# EAGLE design MAME-Controller (EAGLE 6.4)
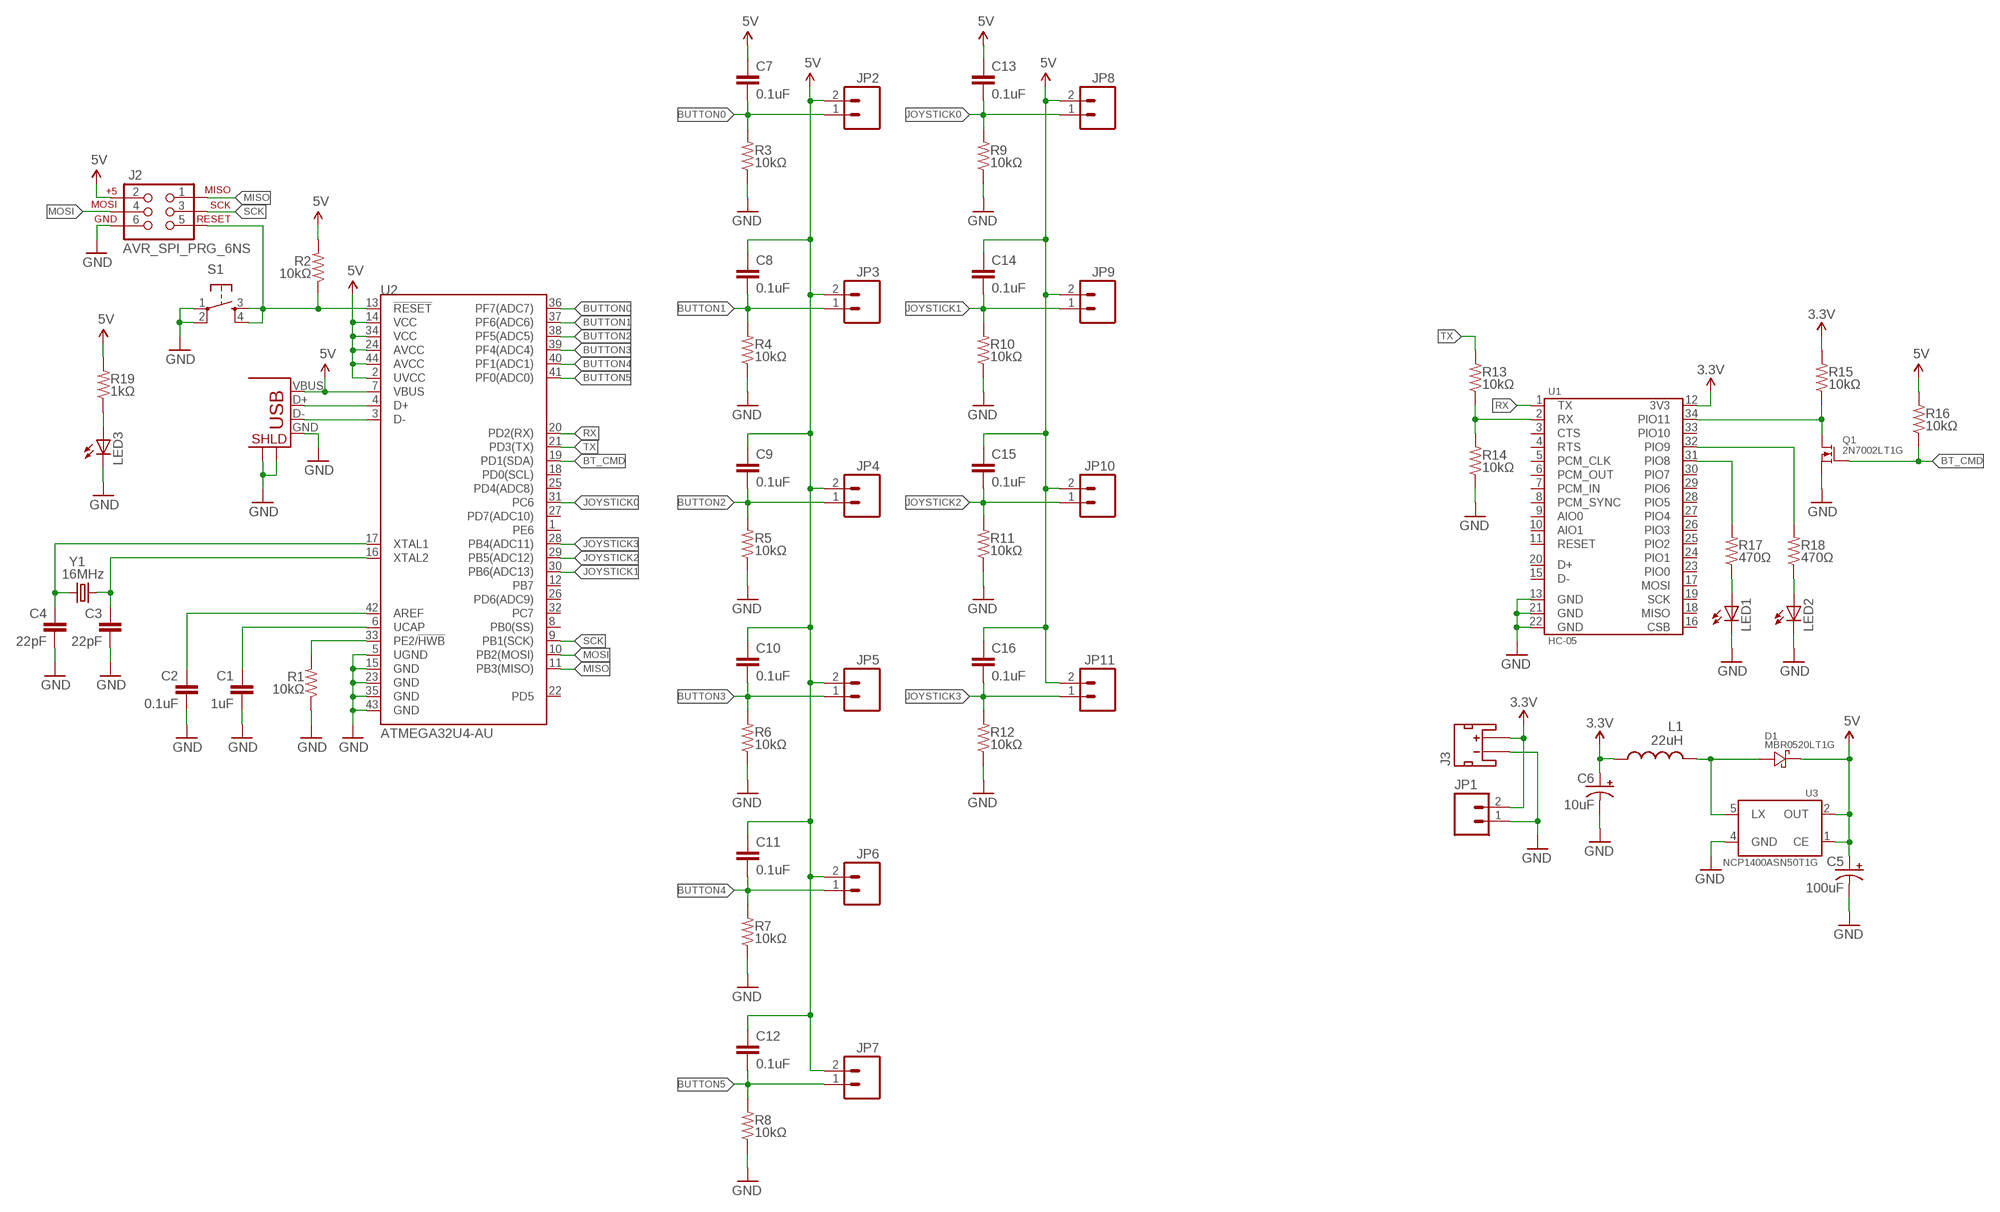
[diagram p0: schematic, sheet 1]

## Parts
C1  1uF  CAP0805  [0805]
C2  0.1uF  CAP0805  [0805]
C3  22pF  CAP0805  [0805]
C4  22pF  CAP0805  [0805]
C5  100uF  CAP_POL-0.35X0.5  [CAP_POL-0.35X0.5]
C6  10uF  CAP_POL1206-KIT  [EIA3216-KIT]
C7  0.1uF  CAP0805  [0805]
C8  0.1uF  CAP0805  [0805]
C9  0.1uF  CAP0805  [0805]
C10  0.1uF  CAP0805  [0805]
C11  0.1uF  CAP0805  [0805]
C12  0.1uF  CAP0805  [0805]
C13  0.1uF  CAP0805  [0805]
C14  0.1uF  CAP0805  [0805]
C15  0.1uF  CAP0805  [0805]
C16  0.1uF  CAP0805  [0805]
D1  MBR0520LT1G  [SOD123]
J1  USB+SHIELD  [USB-B-PTH]
J2  AVR_SPI_PRG_6NS  [2X3-NS]
J3  JST_2MM_MALE  [JST-2-SMD]
JP1  M02PTH  [1X02]
JP2  M02POLAR  [MOLEX-1X2]
JP3  M02POLAR  [MOLEX-1X2]
JP4  M02POLAR  [MOLEX-1X2]
JP5  M02POLAR  [MOLEX-1X2]
JP6  M02POLAR  [MOLEX-1X2]
JP7  M02POLAR  [MOLEX-1X2]
JP8  M02POLAR  [MOLEX-1X2]
JP9  M02POLAR  [MOLEX-1X2]
JP10  M02POLAR  [MOLEX-1X2]
JP11  M02POLAR  [MOLEX-1X2]
L1  22uH  INDUCTOR0805  [0805]
LED1  LED-FKIT-1206  [FKIT-LED-1206]
LED2  LED-FKIT-1206  [FKIT-LED-1206]
LED3  LED-FKIT-1206  [FKIT-LED-1206]
Q1  2N7002LT1G  [SOT23]
R1  10kΩ  RESISTOR0805-RES  [0805]
R2  10kΩ  RESISTOR0805-RES  [0805]
R3  10kΩ  RESISTOR0805-RES  [0805]
R4  10kΩ  RESISTOR0805-RES  [0805]
R5  10kΩ  RESISTOR0805-RES  [0805]
R6  10kΩ  RESISTOR0805-RES  [0805]
R7  10kΩ  RESISTOR0805-RES  [0805]
R8  10kΩ  RESISTOR0805-RES  [0805]
R9  10kΩ  RESISTOR0805-RES  [0805]
R10  10kΩ  RESISTOR0805-RES  [0805]
R11  10kΩ  RESISTOR0805-RES  [0805]
R12  10kΩ  RESISTOR0805-RES  [0805]
R13  10kΩ  RESISTOR0805-RES  [0805]
R14  10kΩ  RESISTOR0805-RES  [0805]
R15  10kΩ  RESISTOR0805-RES  [0805]
R16  10kΩ  RESISTOR0805-RES  [0805]
R17  470Ω  RESISTOR0805-RES  [0805]
R18  470Ω  RESISTOR0805-RES  [0805]
R19  1kΩ  RESISTOR0805-RES  [0805]
S1  TAC_SWITCHSMD  [TACTILE_SWITCH_SMD]
U1  HC-05  [HC-05]
U2  ATMEGA32U4-AU  [TQFP-44]
U3  NCP1400ASN50T1G  [SOT23-5]
Y1  16MHz  CRYSTALHC49US  [HC49US]

## Nets
3.3V: C6.A(+) J3.2(+) JP1.2 L1.2 R15.2 U1.12(3V3)
5V: C5.+ C7.1 C8.1 C9.1 C10.1 C11.1 C12.1 C13.1 C14.1 C15.1 C16.1 D1.CATHODE(C) J1.VBUS J2.2 JP2.2 JP3.2 JP4.2 JP5.2 JP6.2 JP7.2 JP8.2 JP9.2 JP10.2 JP11.2 R2.2 R16.2 R19.2 U2.2(UVCC) U2.7(VBUS) U2.14(VCC) U2.24(AVCC) U2.34(VCC) U2.44(AVCC) U3.1(CE) U3.2(OUT)
BT_CMD: Q1.1(GATE) R16.1 U2.19(PD1(SDA))
BUTTON0: C7.2 JP2.1 R3.2 U2.36(PF7(ADC7))
BUTTON1: C8.2 JP3.1 R4.2 U2.37(PF6(ADC6))
BUTTON2: C9.2 JP4.1 R5.2 U2.38(PF5(ADC5))
BUTTON3: C10.2 JP5.1 R6.2 U2.39(PF4(ADC4))
BUTTON4: C11.2 JP6.1 R7.2 U2.40(PF1(ADC1))
BUTTON5: C12.2 JP7.1 R8.2 U2.41(PF0(ADC0))
D_N: J1.D- U2.3(D-)
D_P: J1.D+ U2.4(D+)
GND: C1.2 C2.2 C3.2 C4.2 C5.- C6.C(-) J1.GND J1.S1 J1.S2 J2.6 J3.1(-) JP1.1 LED1.C LED2.C LED3.C Q1.2(SOURCE) R1.1 R3.1 R4.1 R5.1 R6.1 R7.1 R8.1 R9.1 R10.1 R11.1 R12.1 R14.1 S1.1 S1.2 U1.13(GND) U1.21(GND) U1.22(GND) U2.5(UGND) U2.15(GND) U2.23(GND) U2.35(GND) U2.43(GND) U3.4(GND)
JOYSTICK0: C13.2 JP8.1 R9.2 U2.31(PC6)
JOYSTICK1: C14.2 JP9.1 R10.2 U2.30(PB6(ADC13))
JOYSTICK2: C15.2 JP10.1 R11.2 U2.29(PB5(ADC12))
JOYSTICK3: C16.2 JP11.1 R12.2 U2.28(PB4(ADC11))
MISO: J2.1 U2.11(PB3(MISO))
MOSI: J2.4 U2.10(PB2(MOSI))
N$1: R1.2 U2.33(PE2/!HWB)
N$2: C1.1 U2.6(UCAP)
N$3: C2.1 U2.42(AREF)
N$6: C4.1 U2.17(XTAL1) Y1.1
N$7: C3.1 U2.16(XTAL2) Y1.2
N$8: J2.5 R2.1 S1.3 S1.4 U2.13(!RESET)
N$9: D1.ANODE(A) L1.1 U3.5(LX)
N$10: R13.1 R14.2 U1.2(RX)
N$11: R17.2 U1.31(PIO8)
N$12: R18.2 U1.32(PIO9)
N$13: Q1.3(DRAIN) R15.1 U1.34(PIO11)
N$14: LED2.A R18.1
N$15: LED1.A R17.1
N$16: LED3.A R19.1
RX: U1.1(TX) U2.20(PD2(RX))
SCK: J2.3 U2.9(PB1(SCK))
TX: R13.2 U2.21(PD3(TX))
Unconnected: J3.NC1(PAD1) J3.NC2(PAD2) U1.3(CTS) U1.4(RTS) U1.5(PCM_CLK) U1.6(PCM_OUT) U1.7(PCM_IN) U1.8(PCM_SYNC) U1.9(AIO0) U1.10(AIO1) U1.11(RESET) U1.15(D-) U1.16(CSB) U1.17(MOSI) U1.18(MISO) U1.19(SCK) U1.20(D+) U1.23(PIO0) U1.24(PIO1) U1.25(PIO2) U1.26(PIO3) U1.27(PIO4) U1.28(PIO5) U1.29(PIO6) U1.30(PIO7) U1.33(PIO10) U2.1(PE6) U2.8(PB0(SS)) U2.12(PB7) U2.18(PD0(SCL)) U2.22(PD5) U2.25(PD4(ADC8)) U2.26(PD6(ADC9)) U2.27(PD7(ADC10)) U2.32(PC7)

## Library data of the parts
C1-C4 C7-C16 = SparkFun-Passives:CAP: Capacitor Standard 0603 ceramic capacitor, and 0.1" leaded capacitor.
C5 = Passives:CAP_POL
C6 = SparkFun-Passives:CAP_POL: Capacitor Polarized These are standard SMD and PTH capacitors. Normally 10uF, 47uF, and 100uF in electrolytic and tantalum varieties. Always verify the external diameter of the through hole cap, it varies with capacity, voltage, and manufacturer. The EIA devices should be standard.
D1 = ON Semiconductor:MBR0520
J1 = SparkFun-Connectors:USB+SHIELD: USB+Shield USB connector with shield pins connectable
J2 = SparkFun-Connectors:AVR_SPI_PRG_6: AVR ISP 6 Pin This is the reduced ISP connector for AVR programming. Common on Arduino. This footprint will take up less PCB space and can be used with a 10-pin to 6-pin adapter such as SKU: BOB-08508
J3 = SparkFun-Connectors:JST_2MM_MALE: Mates to single-cell LiPo batteries. CONN-08352; PROD_ID: CONN-08352
JP1-JP11 = SparkFun-Connectors:M02: Header 2 Standard 2-pin 0.1" header. Use with straight break away headers (SKU : PRT-00116), right angle break away headers (PRT-00553), swiss pins (PRT-00743), machine pins (PRT-00117), and female headers (PRT-00115). Molex polarized connector foot print use with SKU : PRT-08233 with associated crimp pins and housings.
L1 = SparkFun-Passives:INDUCTOR: Inductors Basic Inductor/Choke - 0603 and 1206. Footprints are not proven and vary greatly between part numbers.
LED1-LED3 = SparkFun-LED:LED: LEDs Standard schematic elements and footprints for 5mm, 3mm, 1206, and 0603 sized LEDs. 5mm - Spark Fun Electronics SKU : COM-00529 (and others)
Q1 = work:2N7002LT1G: N-Channel Enchancement Mode Mosfet DigiKey: 2N7002LT1GOSCT-ND
R1-R19 = SparkFun-Passives:RESISTOR: Resistor Basic schematic elements and footprints for 0603, 1206, and PTH resistors.
S1 = SparkFun-Electromechanical:TAC_SWITCH: Momentary Switch Button commonly used for reset or general input. Spark Fun Electronics SKU : COM-00097 SMT- SWCH-08247; PROD_ID: SWCH-08247
U1 = Passives:HC-05
U2 = Atmel:ATMEGA32U4
U3 = ON Semiconductor:NCP1400
Y1 = SparkFun-FreqCtrl:CRYSTAL: Various standard crystals. Proven footprints. Spark Fun Electronics SKU : COM-00534

## Net classes
1 usb: clearance 0.508 mm

## Board
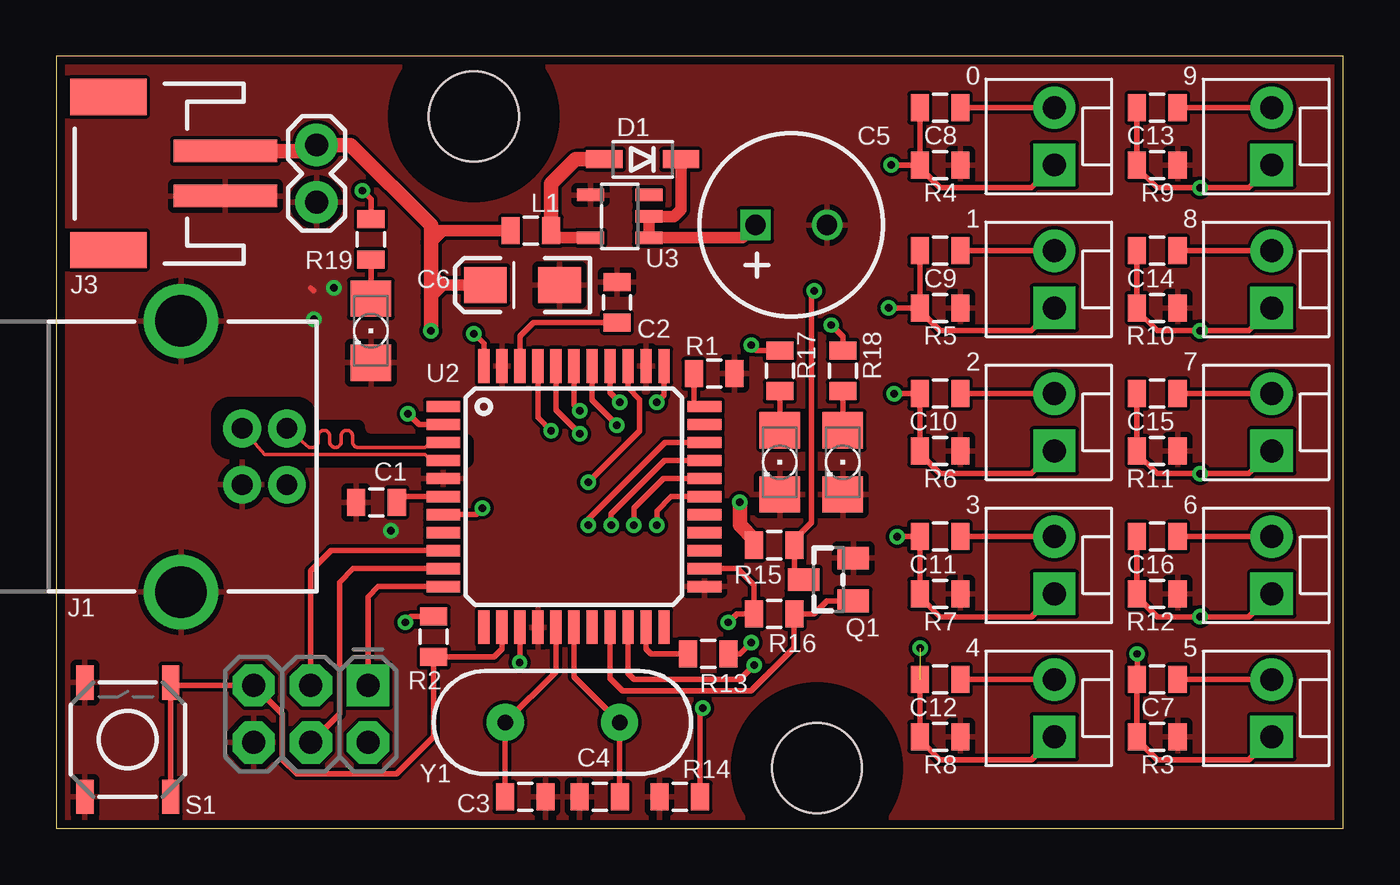
[diagram p1: board, top side]
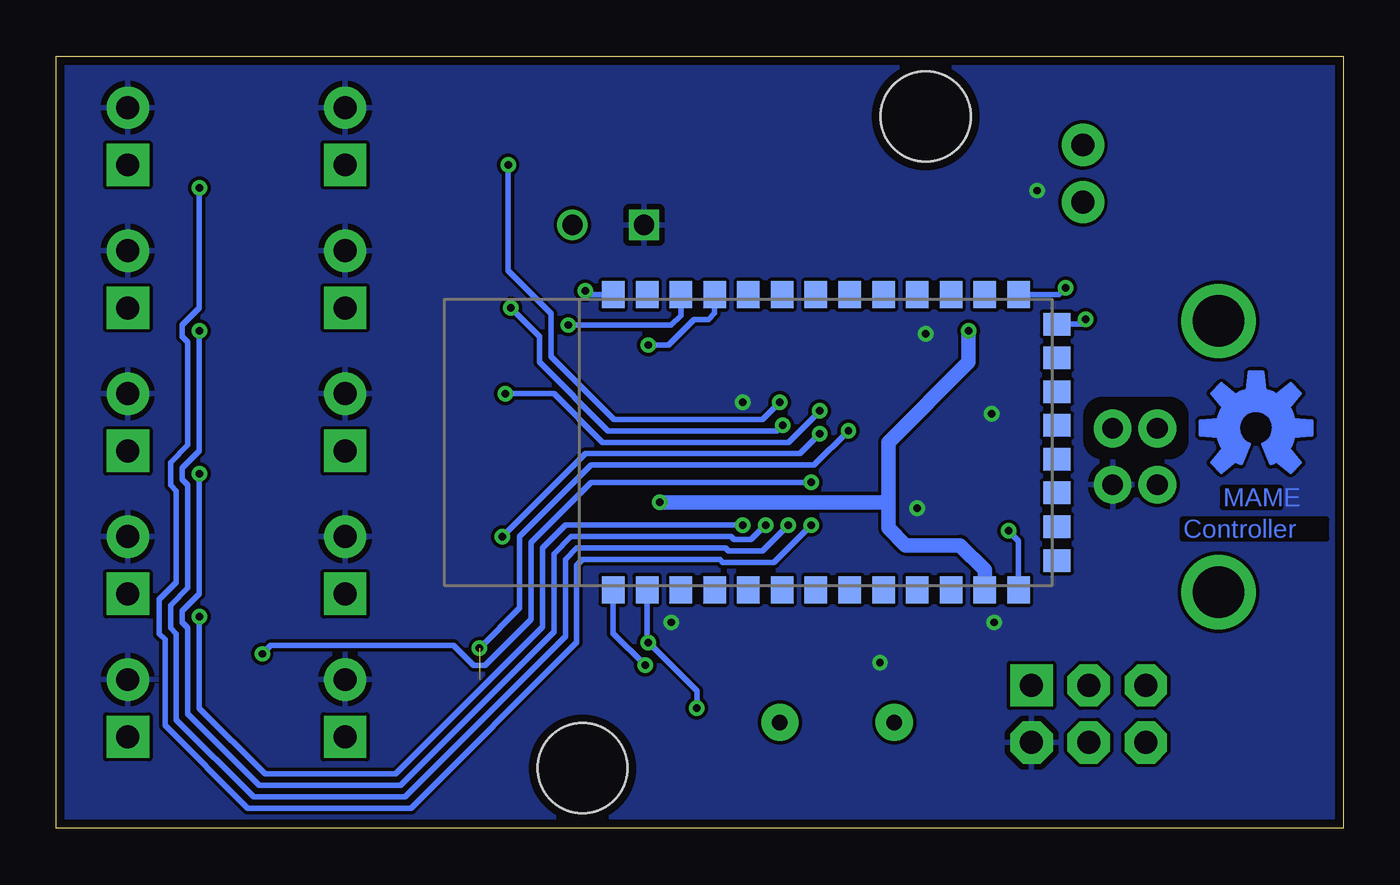
[diagram p2: board, bottom side, seen from below]

Size 57.15 x 34.29 mm. Coordinates in mm from the lower left corner, seen from the top.
Outline: 0,0 57.15,0 57.15,34.29 0,34.29 0,0
Copper layers (1*16): Top 0.0356mm / dielectric 1.5011mm / Bottom 0.0356mm
Design rules "oshpark-2layer *": minimum track width 6mil, minimum drill 13mil, track to track 6mil, track to pad 6mil, pad to pad 6mil, via to via 6mil, smd to smd 6mil, copper to edge 15mil, drill to drill 6mil, minimum pad ring 7mil, minimum via ring 7mil, stop-mask expansion 4mil, vias tented up to drill 20mil, thermal gap 10mil
Holes 4 mm at 18.54,31.62 33.78,2.67
tRestrict: area 7,16.1 to 18.4,19.1; area 30.2,-0.9 to 37.3,6.2; area 15,28.1 to 22.1,35.2
bRestrict: area 7,16.5 to 11.4,19.1

### Footprints (pad centres in the part's own frame; a part is rotated, then mirrored left to right if it is on the bottom)
0805 = smd 0.8 x 1.2: 1 -0.9,0; 2 0.9,0
CAP_POL-0.35X0.5 = drill 0.9 square: + 1.587,0 | drill 0.9: - -1.587,0
EIA3216-KIT = smd 1.9 x 1.6: A 1.65,0; C -1.65,0
SOD123 = smd 1.6 x 0.8: ANODE 1.7,0; CATHODE -1.7,0
USB-B-PTH = drill 0.914 pad 1.676: D+ 0,1.25; D- 1.981,1.25; GND 0,-1.25; VBUS 1.981,-1.25 | drill 2.286: S1 -2.718,-6.02; S2 -2.718,6.02
2X3-NS = drill 1.016 pad 1.88 square: 1 -2.54,-1.27 | drill 1.016 pad 1.88 octagon: 2 -2.54,1.27; 3 0,-1.27; 4 0,1.27; 5 2.54,-1.27; 6 2.54,1.27
JST-2-SMD = smd 1 x 4.6: 1 -1,-3.7; 2 1,-3.7 | smd 1.6 x 3.4: NC1 -3.4,1.5; NC2 3.4,1.5
1X02 = drill 1.016 pad 1.88: 1 0,0; 2 2.54,0
MOLEX-1X2 = drill 1.016 pad 1.88 square: 1 0,0 | drill 1.016 pad 1.88: 2 2.54,0
FKIT-LED-1206 = smd 1.6 x 1.803: A -1.422,0; C 1.422,0
SOT23 = smd 1 x 1.4: 1 -0.95,-1.1; 2 0.95,-1.1; 3 0,1.1
TACTILE_SWITCH_SMD = smd 1.524 x 0.762: 1 -2.54,1.905; 2 2.54,1.905; 3 -2.54,-1.905; 4 2.54,-1.905
HC-05 = smd 1.2 x 1: 1 -6.55,6; 2 -6.55,4.5; 3 -6.55,3; 4 -6.55,1.5; 5 -6.55,0; 6 -6.55,-1.5; 7 -6.55,-3; 8 -6.55,-4.5; 9 -6.55,-6; 10 -6.55,-7.5; 11 -6.55,-9; 12 -6.55,-10.5; 13 -6.55,-12; 22 6.55,-12; 23 6.55,-10.5; 24 6.55,-9; 25 6.55,-7.5; 26 6.55,-6; 27 6.55,-4.5; 28 6.55,-3; 29 6.55,-1.5; 30 6.55,0; 31 6.55,1.5; 32 6.55,3; 33 6.55,4.5; 34 6.55,6 | smd 1 x 1.2: 14 -5.25,-13.7; 15 -3.75,-13.7; 16 -2.25,-13.7; 17 -0.75,-13.7; 18 0.75,-13.7; 19 2.25,-13.7; 20 3.75,-13.7; 21 5.25,-13.7
TQFP-44 = smd 1.5 x 0.5: 1 -5.8,4; 2 -5.8,3.2; 3 -5.8,2.4; 4 -5.8,1.6; 5 -5.8,0.8; 6 -5.8,0; 7 -5.8,-0.8; 8 -5.8,-1.6; 9 -5.8,-2.4; 10 -5.8,-3.2; 11 -5.8,-4; 23 5.8,-4; 24 5.8,-3.2; 25 5.8,-2.4; 26 5.8,-1.6; 27 5.8,-0.8; 28 5.8,0; 29 5.8,0.8; 30 5.8,1.6; 31 5.8,2.4; 32 5.8,3.2; 33 5.8,4 | smd 0.5 x 1.5: 12 -4,-5.8; 13 -3.2,-5.8; 14 -2.4,-5.8; 15 -1.6,-5.8; 16 -0.8,-5.8; 17 0,-5.8; 18 0.8,-5.8; 19 1.6,-5.8; 20 2.4,-5.8; 21 3.2,-5.8; 22 4,-5.8; 34 4,5.8; 35 3.2,5.8; 36 2.4,5.8; 37 1.6,5.8; 38 0.8,5.8; 39 0,5.8; 40 -0.8,5.8; 41 -1.6,5.8; 42 -2.4,5.8; 43 -3.2,5.8; 44 -4,5.8
SOT23-5 = smd 0.55 x 1.2: 1 -0.95,-1.3; 2 0,-1.3; 3 0.95,-1.3; 4 0.95,1.3; 5 -0.95,1.3
HC49US = drill 0.7 pad 1.651: 1 -2.54,0; 2 2.54,0

### Placement (x,y rotation side)
C1  14.22,14.48 180 top
C2  24.89,23.37 90 top
C3  20.83,1.4 0 top
C4  24.13,1.4 180 top
C5  32.64,26.8 180 top
C6  20.7,24.13 180 top
C7  48.9,6.6 180 top
C8  39.24,32 180 top
C9  39.24,25.65 180 top
C10  39.24,19.3 180 top
C11  39.24,12.95 180 top
C12  39.24,6.6 180 top
C13  48.9,32 180 top
C14  48.9,25.65 180 top
C15  48.9,19.3 180 top
C16  48.9,12.95 180 top
D1  26.04,29.72 180 top
J1  8.26,16.51 0 top
J2  11.3,5.08 180 top
J3  3.81,29.08 90 top
JP1  11.56,27.81 90 top
JP2  53.98,4.06 90 top
JP3  44.32,29.46 90 top
JP4  44.32,23.11 90 top
JP5  44.32,16.76 90 top
JP6  44.32,10.41 90 top
JP7  44.32,4.06 90 top
JP8  53.98,29.46 90 top
JP9  53.98,23.11 90 top
JP10  53.98,16.76 90 top
JP11  53.98,10.41 90 top
L1  21.08,26.54 180 top
LED1  32.13,16.26 270 top
LED2  34.92,16.26 270 top
LED3  13.97,22.1 270 top
Q1  34.29,11.05 90 top
R1  29.21,20.19 180 top
R2  16.76,8.51 90 top
R3  48.9,4.06 180 top
R4  39.24,29.46 180 top
R5  39.24,23.11 180 top
R6  39.24,16.76 180 top
R7  39.24,10.41 180 top
R8  39.24,4.06 180 top
R9  48.9,29.46 180 top
R10  48.9,23.11 180 top
R11  48.9,16.76 180 top
R12  48.9,10.41 180 top
R13  28.96,7.75 180 top
R14  27.69,1.4 0 top
R15  31.88,12.57 180 top
R16  31.88,9.53 180 top
R17  32.13,20.32 90 top
R18  34.92,20.32 90 top
R19  13.97,26.16 90 top
S1  3.17,3.94 90 top
U1  26.42,17.14 90 bottom
U2  22.99,14.73 0 top
U3  25.02,27.18 90 top
U$1  [OSHW-LOGO-M-TOP]  3.87,17.78 0 bottom
Y1  22.48,4.7 180 top

### Tracks (layer width: path | path; a pad name or v marks a point on that pad's centre or on a via)
3.3V  (via drill 0.33)
  Top 0.508: L1.2 17.14,26.54 | 17.14,26.54 16.76,26.54 16.64,26.67 | C6.A 17.14,24.13 | 17.14,24.13 16.76,24.13 16.64,24.26 | 17.14,24.13 16.64,24.64 | 17.14,24.13 16.64,23.62 | 17.14,26.54 16.64,26.04
  Top 0.635: J3.2 11.29,30.08 JP1.2 13.08,30.35 16.64,26.8 16.64,26.67 16.64,26.04 16.64,24.64 16.64,24.26 16.64,23.62 v16.64,22.1 | R15.2 30.98,12.84 30.35,13.46 v30.35,14.48
  Bottom 0.635: v16.64,22.1 16.64,20.7 20.19,17.14 20.19,14.48 | 20.19,14.48 20.19,13.34 19.43,12.57 17.02,12.57 15.92,11.47 U1.12 | 20.19,14.48 v30.35,14.48
5V  (via drill 0.33)
  Top 0.254: U2.7 18.63,13.93 v18.92,14.22 | U2.34 26.99,19.24 v26.67,18.92 | v29.84,9.14 30.23,9.53 R16.2 30.98,10.81 30.25,11.53 U2.24 | U2.2 16.1,17.93 v15.62,18.41 | U2.44 18.99,21.53 v18.54,21.97 | R19.2 13.97,27.94 v13.59,28.32 | JP8.2 C13.1 | JP9.2 C14.1 | JP10.2 C15.1 | JP11.2 C16.1 | JP2.2 C7.1 | JP3.2 C8.1 | JP4.2 C9.1 | JP5.2 C10.1 | JP6.2 C11.1 | JP7.2 C12.1 | U2.14 20.59,7.38 v20.57,7.37 | R2.2 15.76,9.41 v15.49,9.14
  Top 0.508: D1.CATHODE 27.73,27.48 27.43,27.18 U3.2 U3.1 30.48,26.23 C5.+
  pour Bottom: -2.54,-2.54 59.69,-2.54 59.69,36.83 -2.54,36.83
BT_CMD
  Top 0.254: Q1.1 34.23,10.1 33.66,9.53 R16.1 32.77,9.51 32.77,8.01 30.86,6.1 25.15,6.1 24.59,6.66 U2.19
BUTTON0  (via drill 0.33)
  Top 0.254: JP2.1 52.96,3.05 48.9,3.05 47.99,3.95 R3.2 C7.2 48.01,6.62 v48.01,7.75 | U2.36 25.39,19.57 25.91,19.05 25.91,17.65 v23.62,15.37
  Bottom 0.254: v23.62,15.37 33.4,15.37 36.07,12.7 36.07,9.27 38.1,7.24 38.61,7.24 39.5,8.13 47.62,8.13 v48.01,7.75
BUTTON1  (via drill 0.33)
  Top 0.254: JP3.1 43.31,28.45 39.24,28.45 38.34,29.35 R4.2 | R4.2 C8.2 | U2.37 24.59,19.36 v25.02,18.92 | v37.08,29.46 R4.2
  Bottom 0.254: v25.02,18.92 25.78,18.16 32.38,18.16 35.18,20.95 35.18,22.86 37.08,24.77 v37.08,29.46
BUTTON2  (via drill 0.33)
  Top 0.254: JP4.1 43.31,22.1 39.24,22.1 38.34,23 R5.2 | R5.2 C9.2 | U2.38 23.79,19.01 v24.89,17.91 | v36.96,23.11 R5.2
  Bottom 0.254: v24.89,17.91 25.15,17.65 32.64,17.65 35.69,20.7 35.69,21.84 v36.96,23.11
BUTTON3  (via drill 0.33)
  Top 0.254: JP5.1 43.31,15.75 39.24,15.75 38.34,16.65 R6.2 C10.2 v37.21,19.3 | U2.39 22.99,18.8 v23.24,18.54
  Bottom 0.254: v23.24,18.54 24.64,17.14 32.89,17.14 35.05,19.3 v37.21,19.3
BUTTON4  (via drill 0.33)
  Top 0.254: JP6.1 43.31,9.4 39.24,9.4 38.34,10.3 R7.2 C11.2 v37.34,12.95 | U2.40 22.19,18.58 v23.24,17.53
  Bottom 0.254: v23.24,17.53 24.13,16.64 33.66,16.64 v37.34,12.95
BUTTON5  (via drill 0.33)  (1 unrouted)
  Top 0.254: JP7.1 43.31,3.05 39.24,3.05 38.34,3.95 R8.2 C12.2 | U2.41 21.39,18.24 v21.97,17.65
  Bottom 0.254: v21.97,17.65 23.5,16.13 33.4,16.13 36.58,12.95 36.58,9.78 v38.35,8
D_N
  Top 0.152: J1.D- 11.23,16.92 11.38,16.92 arc90 11.63,17.17 11.63,17.42 arc-90 11.89,17.68 arc-90 12.14,17.42 12.14,17.17 arc90 12.39,16.92 arc90 12.65,17.17 12.65,17.42 arc-90 12.9,17.68 arc-90 13.16,17.42 13.16,17.17 arc90 13.41,16.92 16.38,16.92 16.6,17.13 U2.3
D_P
  Top 0.152: J1.D+ 9.25,16.61 16.38,16.61 16.66,16.33 U2.4
GND  (via drill 0.33)
  Top 0.254: 11.43,23.88 11.3,24
  Bottom 0.254: U1.13 14.42,12.77 v14.86,13.21 | U1.21 11.64,22.39 v11.43,22.61 | U1.22 12.63,23.7 v12.32,24
  pour Top: -1.27,-1.27 58.42,-1.27 58.42,35.56 -1.27,35.56
JOYSTICK0  (via drill 0.33)
  Top 0.254: JP8.1 52.96,28.45 v50.8,28.45 48.9,28.45 47.99,29.35 R9.2 C13.2 | U2.31 27.04,17.13 23.62,13.72 v23.62,13.46
  Bottom 0.254: v50.8,28.45 50.8,23.11 51.56,22.35 51.56,21.84 51.31,21.59 51.31,17.02 52.07,16.26 52.07,15.24 51.82,14.99 51.82,10.92 52.58,10.16 52.58,8.64 52.32,8.38 52.32,4.57 48.64,0.89 41.4,0.89 34.04,8.26 34.04,11.68 33.78,11.94 27.69,11.94 27.56,11.81 25.27,11.81 v23.62,13.46
JOYSTICK1  (via drill 0.33)
  Top 0.254: JP9.1 52.96,22.1 v50.8,22.1 48.9,22.1 47.99,23 R10.2 C14.2 | U2.30 27,16.33 24.64,13.97 v24.64,13.46
  Bottom 0.254: v50.8,22.1 50.8,16.76 51.56,16 51.56,15.49 51.31,15.24 51.31,10.67 52.07,9.91 52.07,8.89 51.82,8.64 51.82,4.83 48.39,1.4 41.66,1.4 34.54,8.51 34.54,11.94 34.04,12.45 27.43,12.45 27.3,12.32 25.78,12.32 v24.64,13.46
JOYSTICK2  (via drill 0.33)
  Top 0.254: JP10.1 52.96,15.75 v50.8,15.75 48.9,15.75 47.99,16.65 R11.2 C15.2 | U2.29 26.96,15.53 25.65,14.22 v25.65,13.46
  Bottom 0.254: v50.8,15.75 50.8,10.41 51.56,9.65 51.56,9.14 51.31,8.89 51.31,5.08 48.13,1.91 41.86,1.91 35.05,8.71 35.05,12.19 34.29,12.95 27.18,12.95 27.05,12.83 26.29,12.83 v25.65,13.46
JOYSTICK3  (via drill 0.33)
  Top 0.254: JP11.1 52.96,9.4 v50.8,9.4 48.9,9.4 47.99,10.3 R12.2 C16.2 | U2.28 27.3,14.73 26.67,14.1 v26.67,13.46
  Bottom 0.254: v50.8,9.4 50.8,5.33 47.88,2.41 42.09,2.41 35.56,8.94 35.56,12.45 34.54,13.46 v26.67,13.46
MISO
  Top 0.254: U2.11 14.29,10.73 13.84,10.29 J2.1
MOSI
  Top 0.254: U2.10 13.18,11.53 12.57,10.92 12.57,5.08 J2.4
N$1
  Top 0.254: U2.33 28.31,18.73 R1.2
N$2
  Top 0.254: U2.6 15.38,14.73 C1.1
N$3
  Top 0.254: U2.42 20.59,21.86 21.2,22.47 C2.1
N$6
  Top 0.254: U2.17 22.99,6.73 Y1.1 25.02,1.41 C4.1
N$7
  Top 0.254: U2.16 22.19,6.95 Y1.2 C3.1
N$8
  Top 0.254: S1.3 S1.4 5.21,6.35 J2.5 10.03,5.08 10.03,3.05 10.67,2.41 15.11,2.41 16.76,4.06 R2.1 19.43,7.62 19.79,7.98 U2.13
N$9
  Top 0.508: 22.05,26.61 L1.1 22.3,26.23 U3.5
  Top 0.635: D1.ANODE 23.07,29.72 21.98,28.63 L1.1
N$10  (via drill 0.33)
  Top 0.254: R13.1 30.35,7.75 v30.86,8.26 | R14.2 28.59,5.22 v28.7,5.33
  Bottom 0.254: U1.2 30.92,8.33 v30.86,8.26 28.7,6.1 v28.7,5.33
N$11  (via drill 0.33)
  Top 0.254: v30.86,21.46 31.1,21.22 R17.2
  Bottom 0.254: U1.31 27.92,22.88 28.19,22.61 28.83,22.61 29.97,21.46 v30.86,21.46
N$12  (via drill 0.33)
  Top 0.254: v34.42,22.35 34.92,21.84 R18.2
  Bottom 0.254: U1.32 29.42,22.78 29.84,22.35 v34.42,22.35
N$13  (via drill 0.33)
  Top 0.254: Q1.3 32.78,11.46 R15.1 32.78,12.84 33.53,13.59 33.53,23.75 v33.66,23.88
  Bottom 0.254: U1.34 33.47,23.7 v33.66,23.88
N$14
  Top 0.254: R18.1 LED2.A
N$15
  Top 0.254: R17.1 LED1.A
N$16
  Top 0.254: R19.1 LED3.A
RX  (via drill 0.33)
  Top 0.254: U2.20 25.39,6.87 25.65,6.6 30.35,6.6 v30.99,7.24
  Bottom 0.254: v30.99,7.24 32.42,8.67 U1.1
SCK
  Top 0.254: U2.9 12.21,12.33 11.3,11.43 J2.3
TX
  Top 0.254: U2.21 26.19,7.98 26.42,7.75 R13.2

### Text on the board
Bottom: MAME | Controller
tPlace: 0 | 9 | 1 | 8 | 2 | 7 | 3 | 6 | 4 | 5